# Altium schematic sheet Sheet1.SchDoc: Test
size A2; SheetNumber: 1; SheetTotal: 1
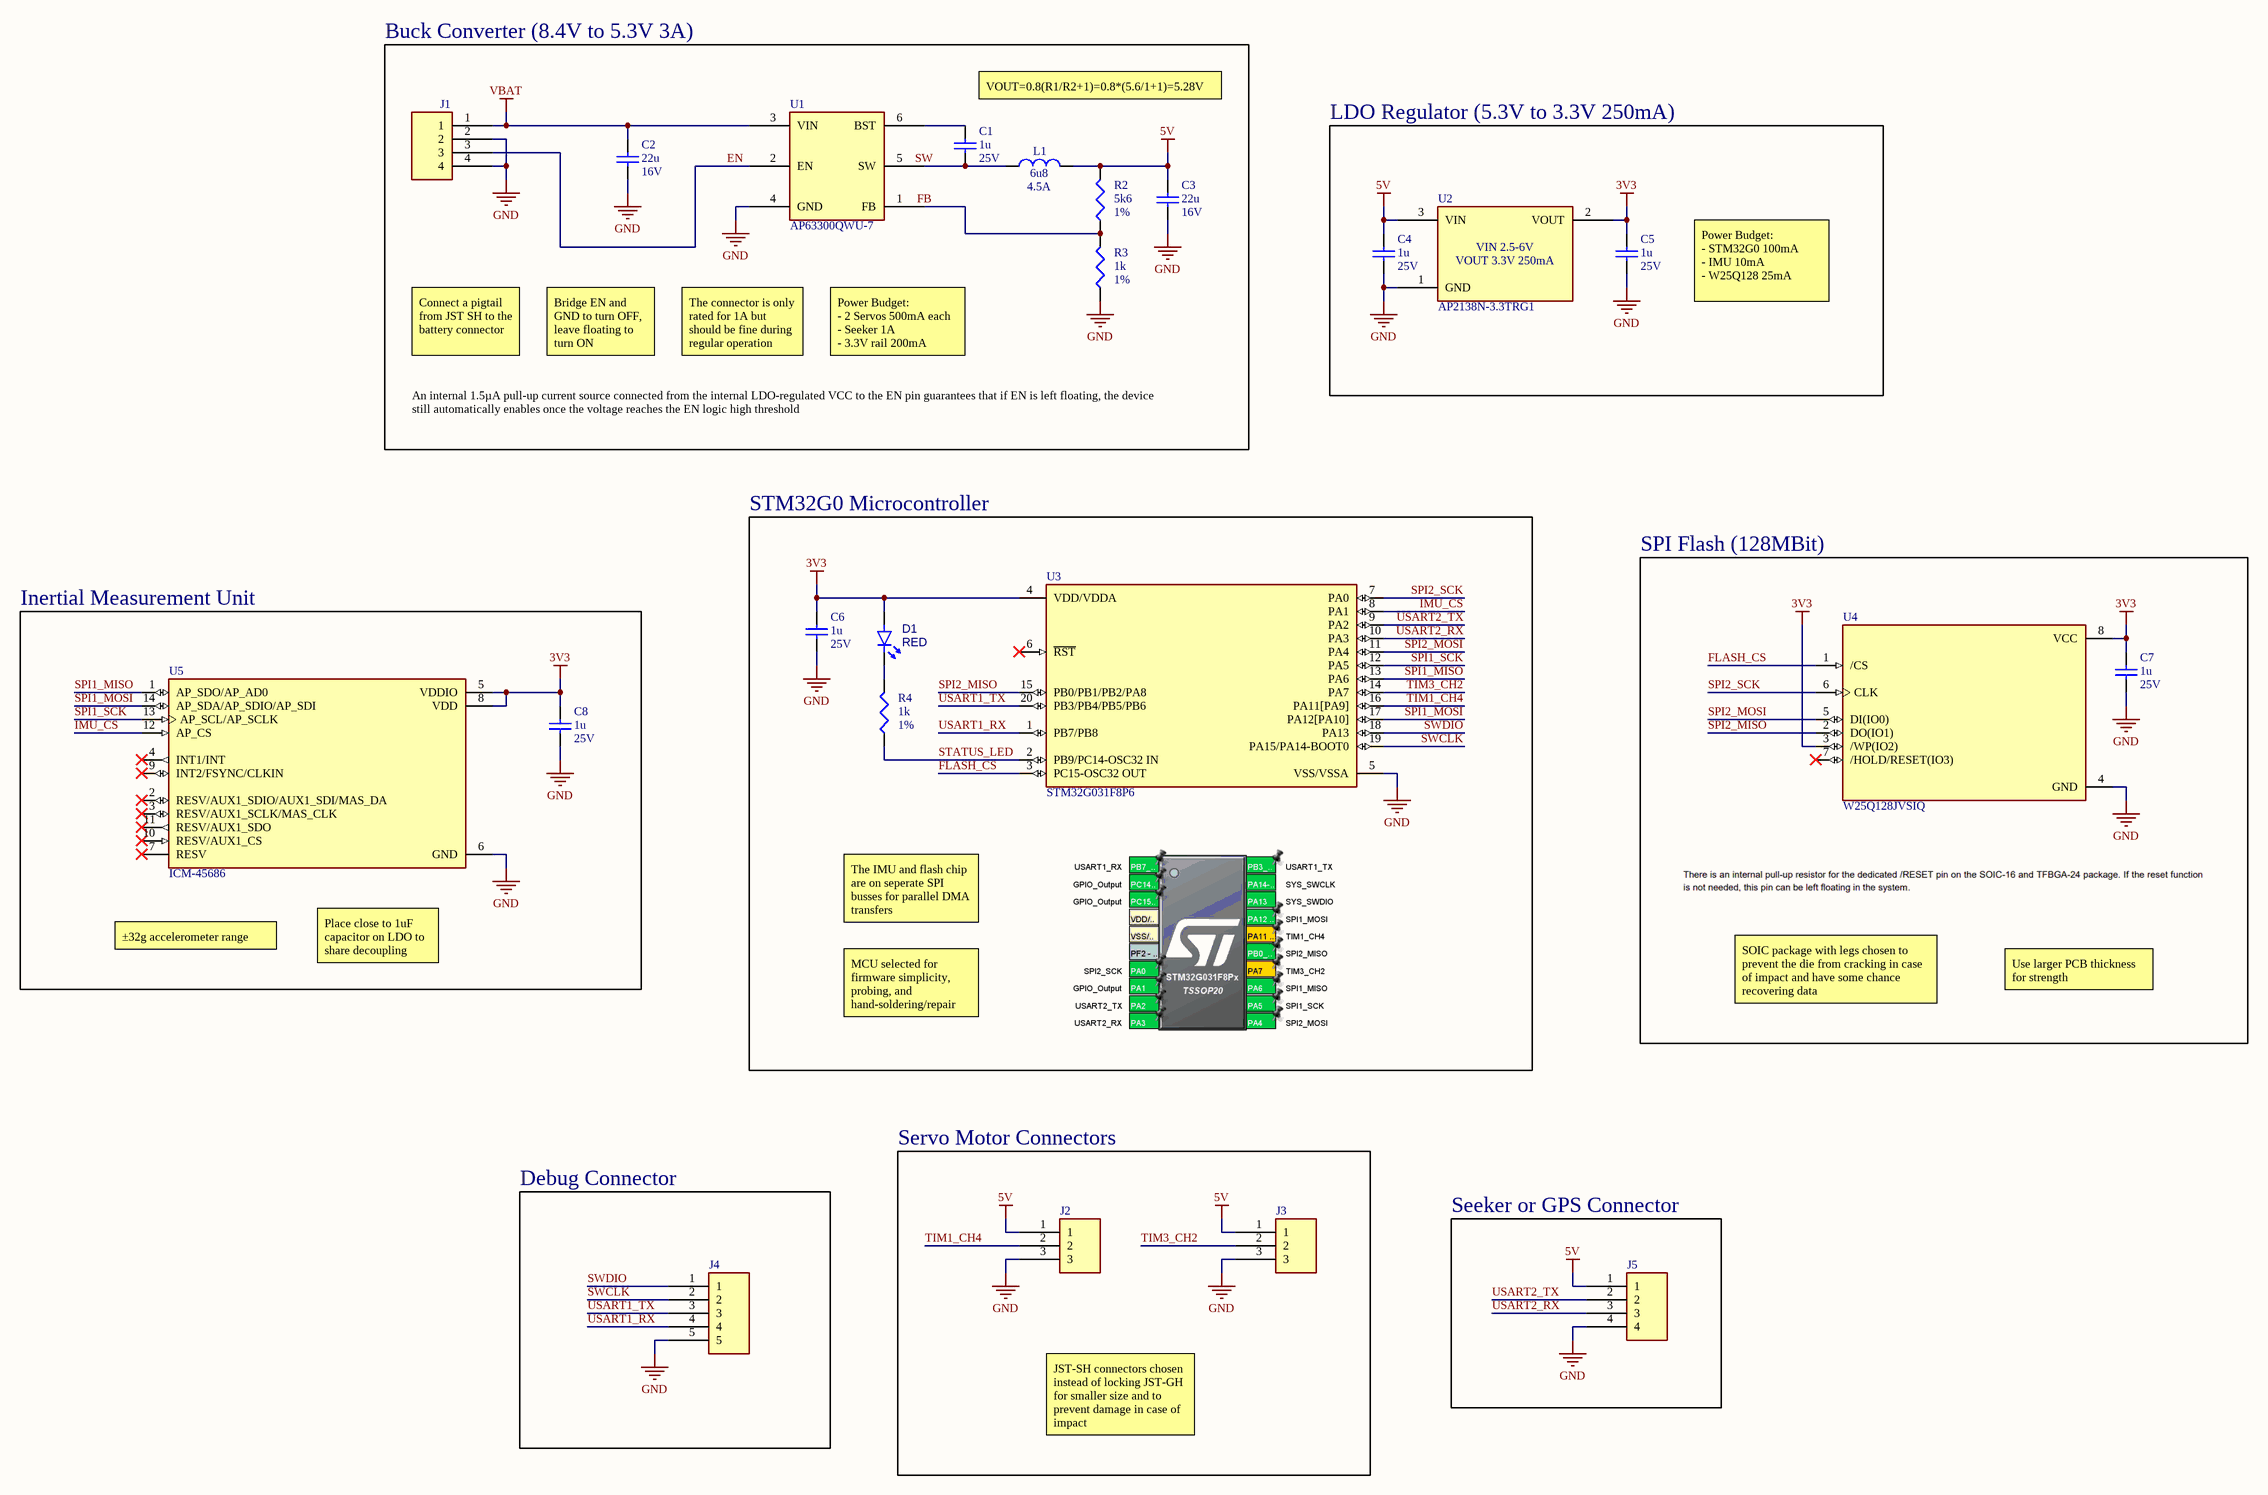
[diagram p0: Sheet1.SchDoc]

## Parts
C1  value 1u  Voltage: 25V  [GRM155R61E105KA12D]  (hidden comment: GRM155R61E105KA12D)
C2  value 22u  Voltage: 16V  [GRM188R61C226ME01D]  (hidden comment: GRM188R61C226ME01D)
C3  value 22u  Voltage: 16V  [GRM188R61C226ME01D]  (hidden comment: GRM188R61C226ME01D)
C4  value 1u  Voltage: 25V  [GRM155R61E105KA12D]  (hidden comment: GRM155R61E105KA12D)
C5  value 1u  Voltage: 25V  [GRM155R61E105KA12D]  (hidden comment: GRM155R61E105KA12D)
C6  value 1u  Voltage: 25V  [GRM155R61E105KA12D]  (hidden comment: GRM155R61E105KA12D)
C7  value 1u  Voltage: 25V  [GRM155R61E105KA12D]  (hidden comment: GRM155R61E105KA12D)
C8  value 1u  Voltage: 25V  [GRM155R61E105KA12D]  (hidden comment: GRM155R61E105KA12D)
D1  RED  [LTST-C281KRKT]
J1  SM04B-SRSS-TB  [SM04B-SRSS-TB]  (value not drawn)
J2  SM03B-SRSS-TB  [SM03B-SRSS-TB]  (value not drawn)
J3  SM03B-SRSS-TB  [SM03B-SRSS-TB]  (value not drawn)
J4  SM05B-SRSS-TB  [SM05B-SRSS-TB]  (value not drawn)
J5  SM04B-SRSS-TB  [SM04B-SRSS-TB]  (value not drawn)
L1  value 6u8  Current Rating: 4.5A  [IHLP2525CZER6R8M01]  (hidden comment: IHLP2525CZER6R8M01)
R2  value 5k6  Tolerance: 1%  [RC0402FR-075K6L]  (hidden comment: RC0402FR-075K6L)
R3  value 1k  Tolerance: 1%  [RC0402FR-071KL]  (hidden comment: RC0402FR-071KL)
R4  value 1k  Tolerance: 1%  [RC0402FR-071KL]  (hidden comment: RC0402FR-071KL)
U1  AP63300QWU-7  [AP63300QWU-7]
U2  AP2138N-3.3TRG1  [AP2138N-3.3TRG1]
U3  STM32G031F8P6  [STM32G031F8P6]
U4  W25Q128JVSIQ  [W25Q128JVSIQ]
U5  ICM-45686  [ICM-45686]

## Blocks framed on the sheet
Buck Converter (8.4V to 5.3V 3A): C1-C3 J1 L1 R2 R3 U1
LDO Regulator (5.3V to 3.3V 250mA): C4 C5 U2
STM32G0 Microcontroller: C6 D1 R4 U3
SPI Flash (128MBit): C7 U4
Inertial Measurement Unit: C8 U5
Debug Connector: J4
Servo Motor Connectors: J2 J3
Seeker or GPS Connector: J5

## Nets
3V3: C5.1 C6.1 C7.1 C8.1 D1.2(A) U2.2(VOUT) U3.4(VDD/VDDA) U4.3(/WP(IO2)) U4.8(VCC) U5.5(VDDIO) U5.8(VDD)
5V: C3.1 C4.1 J2.1 J3.1 J5.1 L1.2 R2.1 U2.3(VIN)
GND: C2.2 C3.2 C4.2 C5.2 C6.2 C7.2 C8.2 J1.2 J1.4 J2.3 J3.3 J4.5 J5.4 R3.2 U1.4(GND) U2.1(GND) U3.5(VSS/VSSA) U4.4(GND) U5.6(GND)
VBAT: C2.1 J1.1 U1.3(VIN)
EN: J1.3 U1.2(EN)
FB: R2.2 R3.1 U1.1(FB)
FLASH_CS: U3.3(PC15-OSC32_OUT) U4.1(/CS)
IMU_CS: U3.8(PA1) U5.12(AP_CS)
SPI1_MISO: U3.13(PA6) U5.1(AP_SDO/AP_AD0)
SPI1_MOSI: U3.17(PA12[PA10]) U5.14(AP_SDA/AP_SDIO/AP_SDI)
SPI1_SCK: U3.12(PA5) U5.13(AP_SCL/AP_SCLK)
SPI2_MISO: U3.15(PB0/PB1/PB2/PA8) U4.2(DO(IO1))
SPI2_MOSI: U3.11(PA4) U4.5(DI(IO0))
SPI2_SCK: U3.7(PA0) U4.6(CLK)
STATUS_LED: R4.2 U3.2(PB9/PC14-OSC32_IN)
SW: C1.2 L1.1 U1.5(SW)
SWCLK: J4.2 U3.19(PA15/PA14-BOOT0)
SWDIO: J4.1 U3.18(PA13)
TIM1_CH4: J2.2 U3.16(PA11[PA9])
TIM3_CH2: J3.2 U3.14(PA7)
USART1_RX: J4.4 U3.1(PB7/PB8)
USART1_TX: J4.3 U3.20(PB3/PB4/PB5/PB6)
USART2_RX: J5.3 U3.10(PA3)
USART2_TX: J5.2 U3.9(PA2)
NetC1_1: C1.1 U1.6(BST)
NetD1_1: D1.1(K) R4.1

Not connected (* = marked no-connect by the designer): U3 6(~{RST})*; U4 7(/HOLD/RESET(IO3))*; U5 2(RESV/AUX1_SDIO/AUX1_SDI/MAS_DA)* 3(RESV/AUX1_SCLK/MAS_CLK)* 4(INT1/INT)* 7(RESV)* 9(INT2/FSYNC/CLKIN)* 10(RESV/AUX1_CS)* 11(RESV/AUX1_SDO)*

## Notes on the sheet
- VOUT=0.8(R1/R2+1)=0.8*(5.6/1+1)=5.28V
- Power Budget:
  - STM32G0 100mA
  - IMU 10mA
  - W25Q128 25mA
- Connect a pigtail from JST SH to the battery connector
- Bridge EN and GND to turn OFF, leave floating to turn ON
- The connector is only rated for 1A but should be fine during regular operation
- Power Budget:
  - 2 Servos 500mA each
  - Seeker 1A
  - 3.3V rail 200mA
- An internal 1.5µA pull-up current source connected from the internal LDO-regulated VCC to the EN pin guarantees that if EN is left floating, the device still automatically enables once the voltage reaches the EN logic high threshold
- ±32g accelerometer range
- Place close to 1uF capacitor on LDO to share decoupling
- The IMU and flash chip are on seperate SPI busses for parallel DMA transfers
- MCU selected for firmware simplicity, probing, and hand-soldering/repair
- SOIC package with legs chosen to prevent the die from cracking in case of impact and have some chance recovering data
- Use larger PCB thickness for strength
- JST-SH connectors chosen instead of locking JST-GH for smaller size and to prevent damage in case of impact
- (in symbol AP2138N-3.3TRG1) VIN 2.5-6V; VOUT 3.3V 250mA

## Library data of the parts
C1 C4-C8 = GRM155R61E105KA12D: CAP 1U 25V X5R 0402; Size: 0402; Dielectric: X5R; Manufacturer Part Number 1: GRM155R61E105KA12D
C2 C3 = GRM188R61C226ME01D: CAP 22U 16V X5R 0603; Size: 0603; Dielectric: X5R; Manufacturer Part Number 1: GRM188R61C226ME01D
D1 = LTST-C281KRKT: LED RED; Size: 0402; Colour: RED; Manufacturer Part Number 1: LTST-C281KRKT
J1 J5 = SM04B-SRSS-TB: JST-SH 4P; Manufacturer Part Number 1: SM04B-SRSS-TB
J2 J3 = SM03B-SRSS-TB: JST-SH 3P; Manufacturer Part Number 1: SM03B-SRSS-TB
J4 = SM05B-SRSS-TB: JST-SH 5P; Manufacturer Part Number 1: SM05B-SRSS-TB
L1 = IHLP2525CZER6R8M01: IND 6.8U 4.5A 60m; Manufacturer Part Number 1: IHLP2525CZER6R8M01
R2 = RC0402FR-075K6L: RES 5.6k 1% 62.5mW 0402; Size: 0603; Manufacturer Part Number 1: RC0402FR-075K6L
R3 R4 = RC0402FR-071KL: RES 1k 1% 62.5mW 0402; Size: 0603; Manufacturer Part Number 1: RC0402FR-071KL
U1 = AP63300QWU-7: BUCK 3A; Manufacturer Part Number 1: AP63300QWU-7
U2 = AP2138N-3.3TRG1: LDO 3.3V 250mA; Manufacturer Part Number 1: AP2138N-3.3TRG1
U3 = STM32G031F8P6: MCU 64MHz 64KB 8KB; ComponentLink2URL: https://www.st.com/resource/en/datasheet/stm32g030f6.pdf; ComponentLink2Description: Datasheet; Manufacturer Part Number 1: STM32G031F8P6
U4 = W25Q128JVSIQ: FLASH - NOR Memory IC 128Mb (16M x 8) SPI - Quad I/O, QPI, DTR 133 MHz 8-SOIC; MF: Winbond Electronics; SnapEDA_Link: https://www.snapeda.com/parts/W25Q128JVSIQ/Winbond/view-part/?ref=snap; Package: SOIC-8 Winbond Electronics; MP: W25Q128JVSIQ; Check_prices: https://www.snapeda.com/parts/W25Q128JVSIQ/Winbond/view-part/?ref=eda; Manufacturer Part Number 1: W25Q128JVSIQ
U5 = ICM-45686: Accelerometer, Gyroscope, 6 Axis Sensor I2C, I3C, SPI Output; Manufacturer Part Number 1: ICM-45686